# Altium schematic sheet Block Diagram.SchDoc
size A4
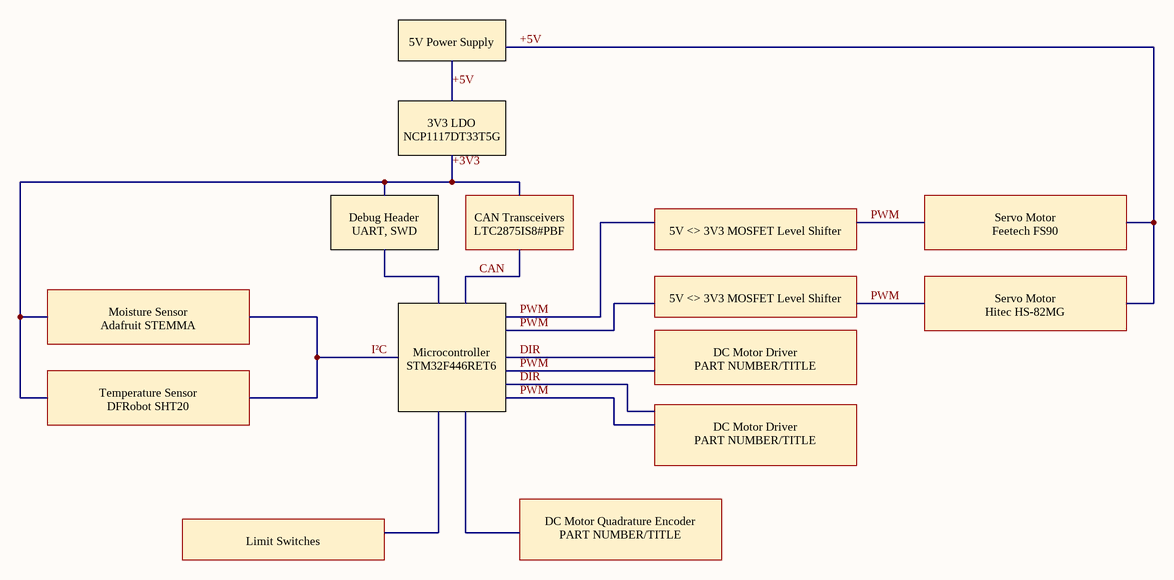
[diagram p0: Block Diagram.SchDoc]

## Notes on the sheet
- 5V Power Supply
- 3V3 LDO
  NCP1117DT33T5G
- Debug Header
  UART, SWD
- CAN Transceivers
  LTC2875IS8#PBF
- 5V <> 3V3 MOSFET Level Shifter
- Servo Motor
  Feetech FS90
- Moisture Sensor
  Adafruit STEMMA
- DC Motor Driver
  PART NUMBER/TITLE
- Servo Motor
  Hitec HS-82MG
- Temperature Sensor
  DFRobot SHT20
- Microcontroller
  STM32F446RET6
- Limit Switches
- DC Motor Quadrature Encoder
  PART NUMBER/TITLE